# Altium schematic sheet 002_PowerSupply.SchDoc
size A4; Organization: OLTEST; Revision: 1; SheetNumber: 2; SheetTotal: 12; Название листа: Название листа; Разработчик: Бондарчук С.; Прибор: R100; АМАК.000000.000 Э3: R100.220.040.000 Э3; Дата: 03.01.2018; Формат: A4
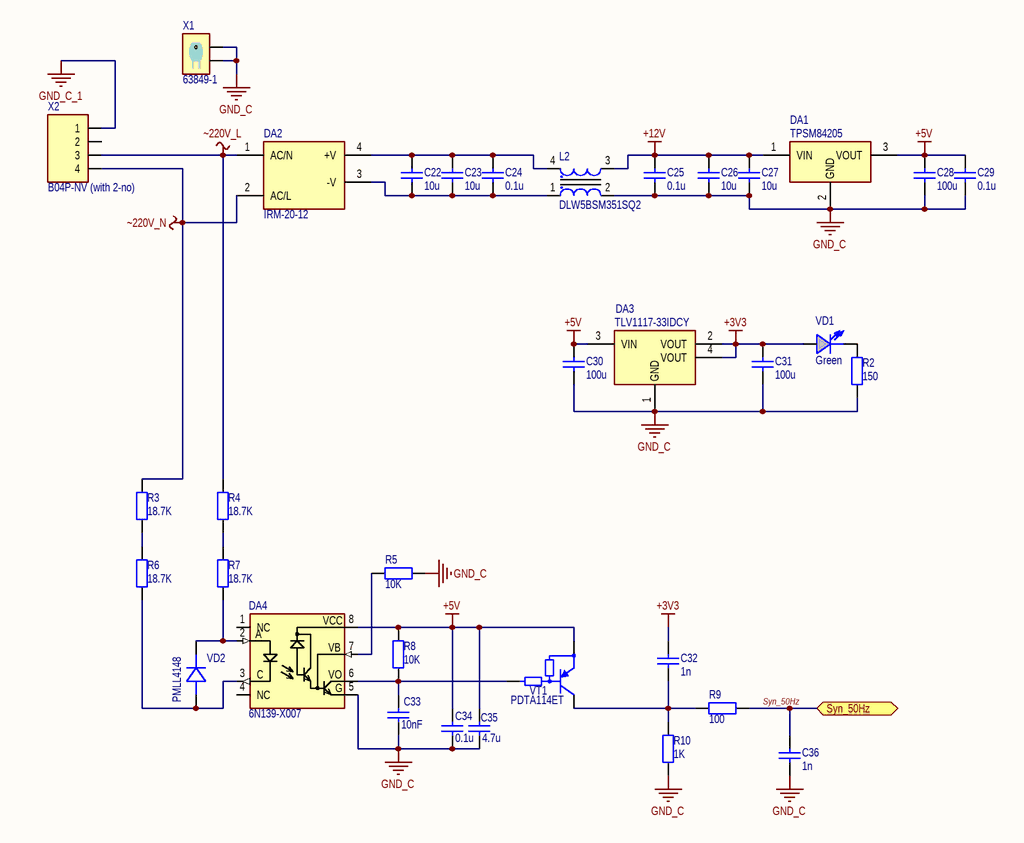
[diagram p0: 002_PowerSupply.SchDoc]

## Parts
C22  10u  [SMD_C_1206]
C23  10u  [SMD_C_1206]
C24  0.1u  [SMD_C_0603]
C25  0.1u  [SMD_C_0603]
C26  10u  [SMD_C_1206]
C27  10u  [SMD_C_1206]
C28  100u  [SMD_C_0805]
C29  0.1u  [SMD_C_0603]
C30  100u  [SMD_C_0805]
C31  100u  [SMD_C_0805]
C32  1n  [SMD_C_0603]
C33  10nF  [SMD_C_0603]
C34  0.1u  [SMD_C_0603]
C35  4.7u  [SMD_C_0805]
C36  1n  [SMD_C_0603]
DA1  TPSM84205  [EAB (SIP DCDC Module)]
DA2  IRM-20-12  [IRM-20-12]
DA3  TLV1117-33IDCY  [SOT-223_M]
DA4  6N139-X007  [6N139-X007]
L2  DLW5BSM351SQ2  [DLW5BS(AH)]
R2  150  [SMD_R_0805]
R3  18.7K  [SMD_R_1206]
R4  18.7K  [SMD_R_1206]
R5  10K  [SMD_R_0603]
R6  18.7K  [SMD_R_1206]
R7  18.7K  [SMD_R_1206]
R8  10K  [SMD_R_0805]
R9  100  [SMD_R_0603]
R10  1K  [SMD_R_0603]
VD1  value Green  [SMD_LED_LL_Green]  (hidden comment: LL-S172GC-2A)
VD2  PMLL4148  [SOD80C]
VT1  PDTA114ET  [SOT23-3]
X1  63849-1  [63849-1]
X2  B04P-NV (with 2-no)  [B04P-NV (with 2-no)]

## Ports
Syn_50Hz

## Nets
+3V3: C31.1 C32.2 DA3.2(VOUT) DA3.4(VOUT) VD1.1(ANODE)
+5V: C28.1 C29.2 C30.1 C34.2 C35.2 DA1.3(VOUT) DA3.3(VIN) DA4.8(VCC) R8.2 VT1.2(E)
+12V: C25.2 C26.2 C27.2 DA1.1(VIN) L2.3
GND_C: C25.1 C26.1 C27.1 C28.2 C29.1 C30.2 C31.2 C33.1 C34.1 C35.1 C36.1 DA1.2(GND) DA3.1(GND) DA4.5 L2.2 R2.1 R5.2 R10.1 X1.1 X1.2
GND_C_1: X2.1
~220V_L: DA2.1(AC/N) R4.2 X2.3
~220V_N: DA2.2(AC/L) R3.2 X2.4
Syn_50Hz: C36.2 R9.2 ; port Syn_50Hz
NetC22_1: C22.1 C23.1 C24.1 DA2.3(-V) L2.1
NetC22_2: C22.2 C23.2 C24.2 DA2.4(+V) L2.4
NetC32_1: C32.1 R9.1 R10.2 VT1.3(C)
NetC33_2: C33.2 DA4.6 R8.1 VT1.1(B)
NetDA4_2: DA4.2 R7.1 VD2.2(CATHODE)
NetDA4_3: DA4.3(C) R6.1 VD2.1(ANODE)
NetDA4_7: DA4.7(VB) R5.1
NetR2_2: R2.2 VD1.2(CATHODE)
NetR3_1: R3.1 R6.2
NetR4_1: R4.1 R7.2

Not connected (* = marked no-connect by the designer): DA4 1(NC) 4(NC); X2 2

## Notes on the sheet
- Разработчик:
- Формат:
- Rev.:
- Лист
- Дата:
- Листов
- Файл:
- Дата изм.:
- (in symbol 6N139-X007) A; VO; G

## Library data of the parts
C22 C23 C26 C27 = C1206 10u 25V 20%: SMD C 1206 MURATA 25V 20% X5R; PartNumber: GRM31MR61E106M; Manufacturer: MURATA; Value: 10u
C24 C25 C29 C34 = C0603 0.1u 50V 10%: SMD C 0603 MURATA 50V 10% X7R; PartNumber: GRM188R71H104K; Manufacturer: MURATA; Value: 0.1u
C28 C30 C31 = C0805 100u 6.3V 20% X5R: SMD 0805 MURATA 6.3V 20% X5R; PartNumber: GRM21BR60J107M; Manufacturer: MURATA; Value: 100u
C32 C36 = C0603 1n 50V 5%: SMD C 0603 MURATA 50V 5% NP0; PartNumber: GRM1885C1H102JA01; Manufacturer: MURATA; Value: 1n
C33 = C0603 10nF 100V 10%: SMD C 0603 MURATA 100V 10% X7R; PartNumber: GRJ188R72A103KE11#; Manufacturer: MURATA; Value: 10nF
C35 = C0805 4.7u 25V 20%  X5R: SMD C 0805 MURATA 50V 5% NP0; PartNumber: GRM21BR61E475M; Manufacturer: MURATA; Value: 4.7u
DA1 = TPSM84205: 1.5A 5Vout up to 28 Vin StepDown module; Manufacturer: Texas Instrument; PartNumber: TPSM84205
DA2 = IRM-20-12: 20W 12VDC 1.85A PCB; Manufacturer: Mean Well; PartNumber: IRM-20-12
DA3 = TLV1117-33IDCY: Voltage regulator 3.3V 800mA; Manufacturer: Texas Instrument; PartNumber: TLV1117-33IDCY
DA4 = 6N139-X007: Optocoupler darlingron 5.3kV 100 kbit/s; Manufacturer: Vishay; PartNumber: 6N139-X007
L2 = DLW5BSM351SQ2: SMD Common Mode Choke Coil 2A Z = 350 Ohm / 100 MHz; Manufacturer: MURATA; PartNumber: DLW5BSM351SQ2
R2 = R0805 150 1%: SMD 0805 VISHAY 0.125W 150V 1% 100ppm; PartNumber: CRCW0805150RFK; Manufacturer: VISHAY; Value: 150
R3 R4 R6 R7 = R1206 18.7K 1%: SMD R 1206 VISHAY 0.25W 200V 1% 100ppm; PartNumber: CRCW120618K7FK; Manufacturer: VISHAY; Value: 18.7K
R5 = R0603 10К 1%: SMD R 0603 VISHAY 0.1W 75V 1% 100ppm; PartNumber: CRCW060310K0FK; Manufacturer: VISHAY; Value: 10K
R8 = R0805 10K 1%: SMD R 0805 VISHAY 0.125W 150V 1% 100ppm; PartNumber: CRCW080510K0FK; Manufacturer: VISHAY; Value: 10K
R9 = R0603 100 1%: SMD R 0603 VISHAY 0.1W 75V 1% 100ppm; PartNumber: CRCW0603100RFK; Manufacturer: VISHAY; Value: 100
R10 = R0603 1K 1%: SMD R 0603 VISHAY 0.1W 75V 1% 100ppm; PartNumber: CRCW06031K00FK; Manufacturer: VISHAY; Value: 1K
VD1 = LL-S172GC-2A: LED Green SMD; Manufacturer: Lucky Light; PartNumber: LL-S172GC-2A
VD2 = PMLL4148: If=0.2A, Vf=1V Vrrm=100V Diode (SOD80C); Manufacturer: NXP Semiconductors; PartNumber: PMLL4148
VT1 = PDTA114ET: Digital Transistor (BRT), R1=10 kOhm, R2=10 kOhm, PNP Transistor; Manufacturer: NXP; PartNumber: PDTA114ET
X1 = 63849-1: PCB, 6.3х0.8, hole; Manufacturer: TE Connectivity; PartNumber: 63849-1
X2 = B04P-NV (with 2-no): NV 4 конт LS=5.0 10A 250V PCB; Manufacturer: JST; PartNumber: B04P-NV